# Altium schematic sheet Core.SchDoc
size A; SheetNumber: 1; SheetTotal: 3
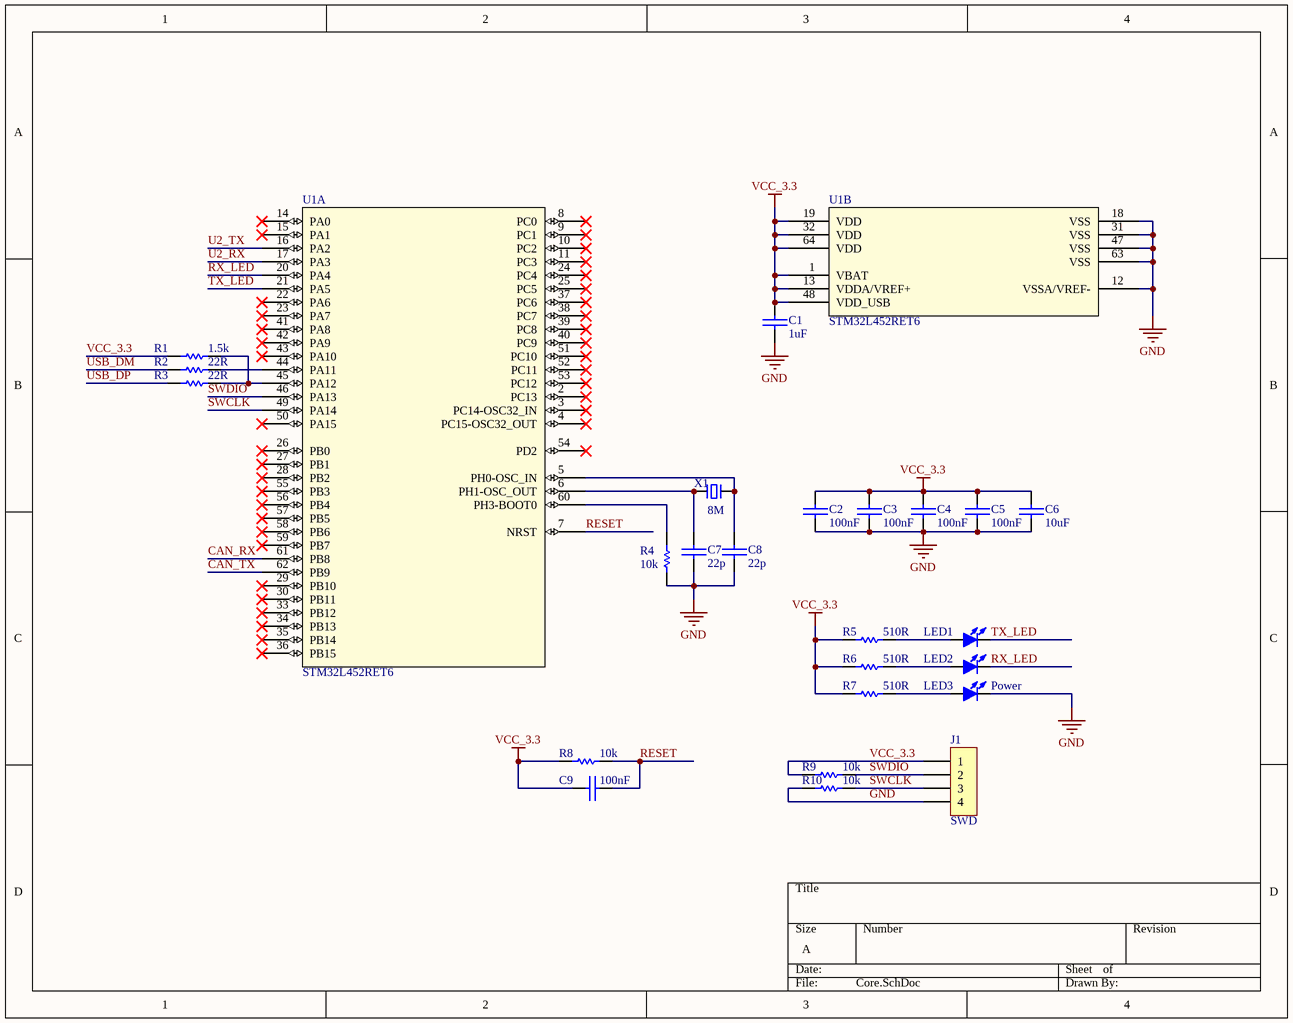
[diagram p0: Core.SchDoc]

## Parts
C1  1uF  [C 0603_L]
C2  100nF  [C 0603_L]
C3  100nF  [C 0603_L]
C4  100nF  [C 0603_L]
C5  100nF  [C 0603_L]
C6  10uF  [C 0603_L]
C7  22p  [C 0603_L]
C8  22p  [C 0603_L]
C9  100nF  [C 0603_L]
J1  SWD  [Pin HDR1X4/2.54mm-S]
LED1  CAN_TX  [LED 0805R]  (value not drawn)
LED2  CAN_RX  [LED 0805G]  (value not drawn)
LED3  Power  [LED 0805B]
R1  1.5k  [0603R]
R2  22R  [0603R]
R3  22R  [0603R]
R4  10k  [0603R]
R5  510R  [0603R]
R6  510R  [0603R]
R7  510R  [0603R]
R8  10k  [0603R]
R9  10k  [0603R]
R10  10k  [0603R]
U1  STM32L452RET6  [LQFP64-10*10]  (parts A,B of 2)
X1  8M  [OSC HC-49S]

## Nets
GND: C1.1 C2.1 C3.1 C4.1 C5.1 C6.1 C7.1 C8.1 J1.4 LED3.2(K) R4.1 R10.1 U1.12(VSSA/VREF-) U1.18(VSS) U1.31(VSS) U1.47(VSS) U1.63(VSS)
VCC_3.3: C1.2 C2.2 C3.2 C4.2 C5.2 C6.2 C9.2 J1.1 R1.1 R5.1 R6.1 R7.1 R8.1 R9.1 U1.1(VBAT) U1.13(VDDA/VREF+) U1.19(VDD) U1.32(VDD) U1.48(VDD_USB) U1.64(VDD)
CAN_RX: U1.61(PB8)
CAN_TX: U1.62(PB9)
RESET: C9.1 R8.2 U1.7(NRST)
RX_LED: LED2.2(K) U1.20(PA4)
SWCLK: J1.3 R10.2 U1.49(PA14)
SWDIO: J1.2 R9.2 U1.46(PA13)
TX_LED: LED1.2(K) U1.21(PA5)
U2_RX: U1.17(PA3)
U2_TX: U1.16(PA2)
USB_DM: R2.1
USB_DP: R3.1
NetC7_2: C7.2 U1.6(PH1-OSC_OUT) X1.1
NetC8_2: C8.2 U1.5(PH0-OSC_IN) X1.2
NetLED1_1: LED1.1(A) R5.2
NetLED2_1: LED2.1(A) R6.2
NetLED3_1: LED3.1(A) R7.2
NetR1_2: R1.2 R3.2 U1.45(PA12)
NetR2_2: R2.2 U1.44(PA11)
NetR4_2: R4.2 U1.60(PH3-BOOT0)

Not connected (* = marked no-connect by the designer): U1 2(PC13)* 3(PC14-OSC32_IN)* 4(PC15-OSC32_OUT)* 8(PC0)* 9(PC1)* 10(PC2)* 11(PC3)* 14(PA0)* 15(PA1)* 22(PA6)* 23(PA7)* 24(PC4)* 25(PC5)* 26(PB0)* 27(PB1)* 28(PB2)* 29(PB10)* 30(PB11)* 33(PB12)* 34(PB13)* 35(PB14)* 36(PB15)* 37(PC6)* 38(PC7)* 39(PC8)* 40(PC9)* 41(PA8)* 42(PA9)* 43(PA10)* 50(PA15)* 51(PC10)* 52(PC11)* 53(PC12)* 54(PD2)* 55(PB3)* 56(PB4)* 57(PB5)* 58(PB6)* 59(PB7)*

## Library data of the parts
C1-C9 = CAP: 无极性电容
J1 = Pin HDR1X4
LED1-LED3 = LED-SMD: 贴片LED; 版权归属: 封装库来自淘宝 ID：黄晶宝石; BOM名称: 贴片LED; 学习资源: https://shop463601444.taobao.com
R1-R10 = RES
U1 = STM32L452RET6: No Description Available; Mfr_Name: STMicroelectronics; RefDes: RefDes; Type: Type
X1 = XTAL-2P: 2脚无源脚晶振